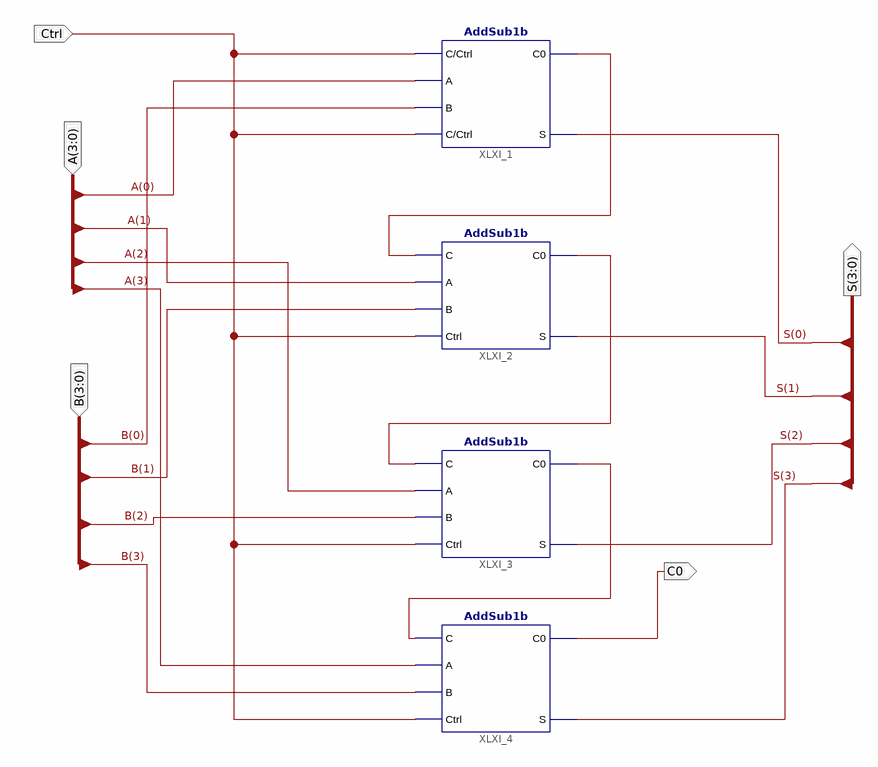
[diagram p0: schematic sheet 1]
// Xilinx ISE schematic AddSub4b.sch (kintex7) as structural Verilog: 4 symbols, 5 ports
module AddSub4b (
  input  Ctrl,
  input  [3:0] A,
  input  [3:0] B,
  output [3:0] S,
  output C0
);

  wire XLXN_12, XLXN_17, XLXN_18;

  AddSub1b XLXI_1 (.C(Ctrl), .A(A[0]), .B(B[0]), .Ctrl(Ctrl), .C0(XLXN_17), .S(S[0]));
  AddSub1b XLXI_2 (.C(XLXN_17), .A(A[1]), .B(B[1]), .Ctrl(Ctrl), .C0(XLXN_18), .S(S[1]));
  AddSub1b XLXI_3 (.C(XLXN_18), .A(A[2]), .B(B[2]), .Ctrl(Ctrl), .C0(XLXN_12), .S(S[2]));
  AddSub1b XLXI_4 (.C(XLXN_12), .A(A[3]), .B(B[3]), .Ctrl(Ctrl), .C0(C0), .S(S[3]));
endmodule
